# EAGLE design Auto2018 (EAGLE 8.7.1)

## Sheet 1 of 3
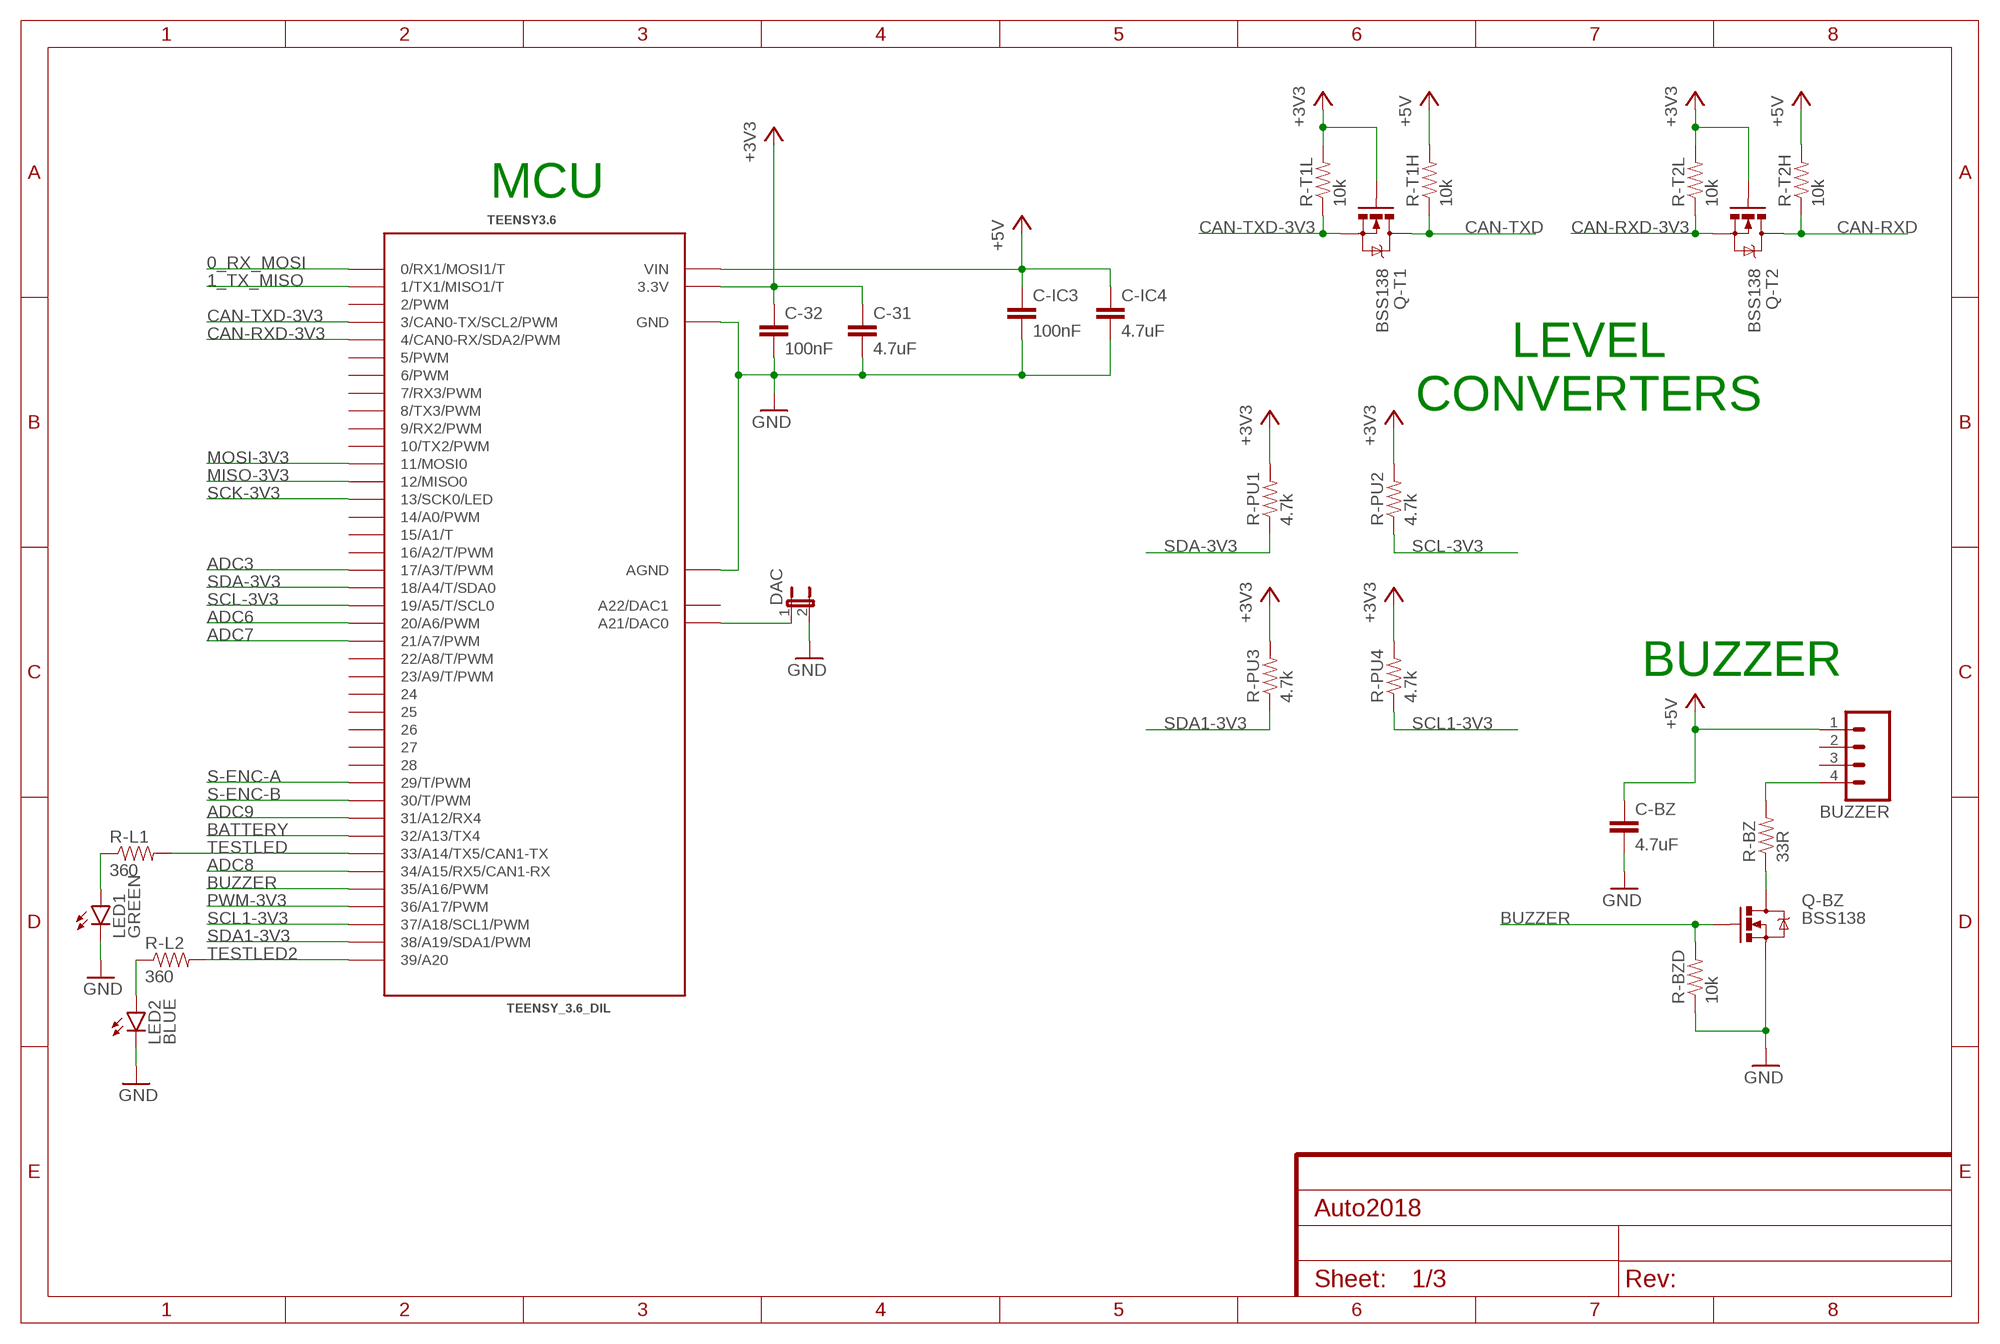
[diagram p0: schematic, sheet 1]
A (FRAME-A4L): CNAME: Auto2018: MCU and Level converters; CREVISION: 2; DESIGNER: Henning

### Parts
BUZZER  M04POLAR  [MOLEX-1X4]
C-31  4.7uF  CAP1210  [1210]
C-32  100nF  CAP0805  [0805]
C-BZ  4.7uF  CAP1210  [1210]
C-IC3  100nF  CAP0805  [0805]
C-IC4  4.7uF  CAP1210  [1210]
DAC  JUMPER-2PTH  [1X02]
LED1  GREEN  LED1206  [LED-1206]
LED2  BLUE  LED1206  [LED-1206]
Q-BZ  BSS138  MOSFET-NCHANNELBSS123LT1G  [SOT23-3]
Q-T1  BSS138  MOSFET-NCHANNELBSS123LT1G  [SOT23-3]
Q-T2  BSS138  MOSFET-NCHANNELBSS123LT1G  [SOT23-3]
R-BZ  33R  RESISTOR0805-RES  [0805]
R-BZD  10k  RESISTOR0805-RES  [0805]
R-L1  360  RESISTOR0805-RES  [0805]
R-L2  360  RESISTOR0805-RES  [0805]
R-PU1  4.7k  RESISTOR0805-RES  [0805]
R-PU2  4.7k  RESISTOR0805-RES  [0805]
R-PU3  4.7k  RESISTOR0805-RES  [0805]
R-PU4  4.7k  RESISTOR0805-RES  [0805]
R-T1H  10k  RESISTOR0805-RES  [0805]
R-T1L  10k  RESISTOR0805-RES  [0805]
R-T2H  10k  RESISTOR0805-RES  [0805]
R-T2L  10k  RESISTOR0805-RES  [0805]
TEENSY3.6  TEENSY_3.6_DIL  [TEENSY_3.6_DIL]

### Nets
0_RX_MOSI: TEENSY3.6.0(0/RX1/MOSI1/T) ; also sheet 3
1_TX_MISO: TEENSY3.6.1(1/TX1/MISO1/T) ; also sheet 3
+3V3: C-31.1 C-32.1 Q-T1.1(G) Q-T2.1(G) R-PU1.2 R-PU2.2 R-PU3.2 R-PU4.2 R-T1L.2 R-T2L.2 TEENSY3.6.3.3V TEENSY3.6.3.3V3(3.3V) ; also sheet 3
+5V: BUZZER.1 C-BZ.1 C-IC3.1 C-IC4.1 R-T1H.2 R-T2H.2 TEENSY3.6.VIN ; also sheet 2,3
ADC3: TEENSY3.6.17/A3(17/A3/T/PWM) ; also sheet 3
ADC6: TEENSY3.6.20/A6(20/A6/PWM) ; also sheet 3
ADC7: TEENSY3.6.21/A7(21/A7/PWM) ; also sheet 3
ADC8: TEENSY3.6.34/A15(34/A15/RX5/CAN1-RX) ; also sheet 3
ADC9: TEENSY3.6.31/A12(31/A12/RX4) ; also sheet 3
BATTERY: TEENSY3.6.32/A13(32/A13/TX4) ; also sheet 3
BUZZER: Q-BZ.1(G) R-BZD.2 TEENSY3.6.35/A16(35/A16/PWM)
CAN-RXD: Q-T2.3(D) R-T2H.1 ; also sheet 2
CAN-RXD-3V3: Q-T2.2(S) R-T2L.1 TEENSY3.6.4(4/CAN0-RX/SDA2/PWM)
CAN-TXD: Q-T1.3(D) R-T1H.1 ; also sheet 2
CAN-TXD-3V3: Q-T1.2(S) R-T1L.1 TEENSY3.6.3(3/CAN0-TX/SCL2/PWM)
GND: C-31.2 C-32.2 C-BZ.2 C-IC3.2 C-IC4.2 DAC.2 LED1.C LED2.C Q-BZ.2(S) R-BZD.1 TEENSY3.6.AGND TEENSY3.6.GND TEENSY3.6.GND1(GND) ; also sheet 2,3
MISO-3V3: TEENSY3.6.12(12/MISO0) ; also sheet 3
MOSI-3V3: TEENSY3.6.11(11/MOSI0) ; also sheet 3
N$1: LED1.A R-L1.1
N$2: LED2.A R-L2.1
N$5: DAC.1 TEENSY3.6.A21(A21/DAC0)
N$14: BUZZER.4 R-BZ.2
N$15: Q-BZ.3(D) R-BZ.1
PWM-3V3: TEENSY3.6.36/A17(36/A17/PWM) ; also sheet 3
S-ENC-A: TEENSY3.6.29(29/T/PWM) ; also sheet 3
S-ENC-B: TEENSY3.6.30(30/T/PWM) ; also sheet 3
SCK-3V3: TEENSY3.6.13(13/SCK0/LED) ; also sheet 3
SCL1-3V3: R-PU4.1 TEENSY3.6.37/A18(37/A18/SCL1/PWM) ; also sheet 3
SCL-3V3: R-PU2.1 TEENSY3.6.19/A5(19/A5/T/SCL0) ; also sheet 2,3
SDA1-3V3: R-PU3.1 TEENSY3.6.38/A19(38/A19/SDA1/PWM) ; also sheet 3
SDA-3V3: R-PU1.1 TEENSY3.6.18/A4(18/A4/T/SDA0) ; also sheet 2,3
TESTLED: R-L1.2 TEENSY3.6.33/A14(33/A14/TX5/CAN1-TX)
TESTLED2: R-L2.2 TEENSY3.6.39/A20
Unconnected: BUZZER.2 BUZZER.3 TEENSY3.6.2(2/PWM) TEENSY3.6.5(5/PWM) TEENSY3.6.6(6/PWM) TEENSY3.6.7(7/RX3/PWM) TEENSY3.6.8(8/TX3/PWM) TEENSY3.6.9(9/RX2/PWM) TEENSY3.6.10(10/TX2/PWM) TEENSY3.6.14/A0(14/A0/PWM) TEENSY3.6.15/A1(15/A1/T) TEENSY3.6.16/A2(16/A2/T/PWM) TEENSY3.6.22/A8(22/A8/T/PWM) TEENSY3.6.23/A9(23/A9/T/PWM) TEENSY3.6.24 TEENSY3.6.25 TEENSY3.6.26 TEENSY3.6.27 TEENSY3.6.28 TEENSY3.6.A22(A22/DAC1)

### Notes on the sheet
- MCU
- LEVEL
  CONVERTERS
- BUZZER

## Sheet 2 of 3
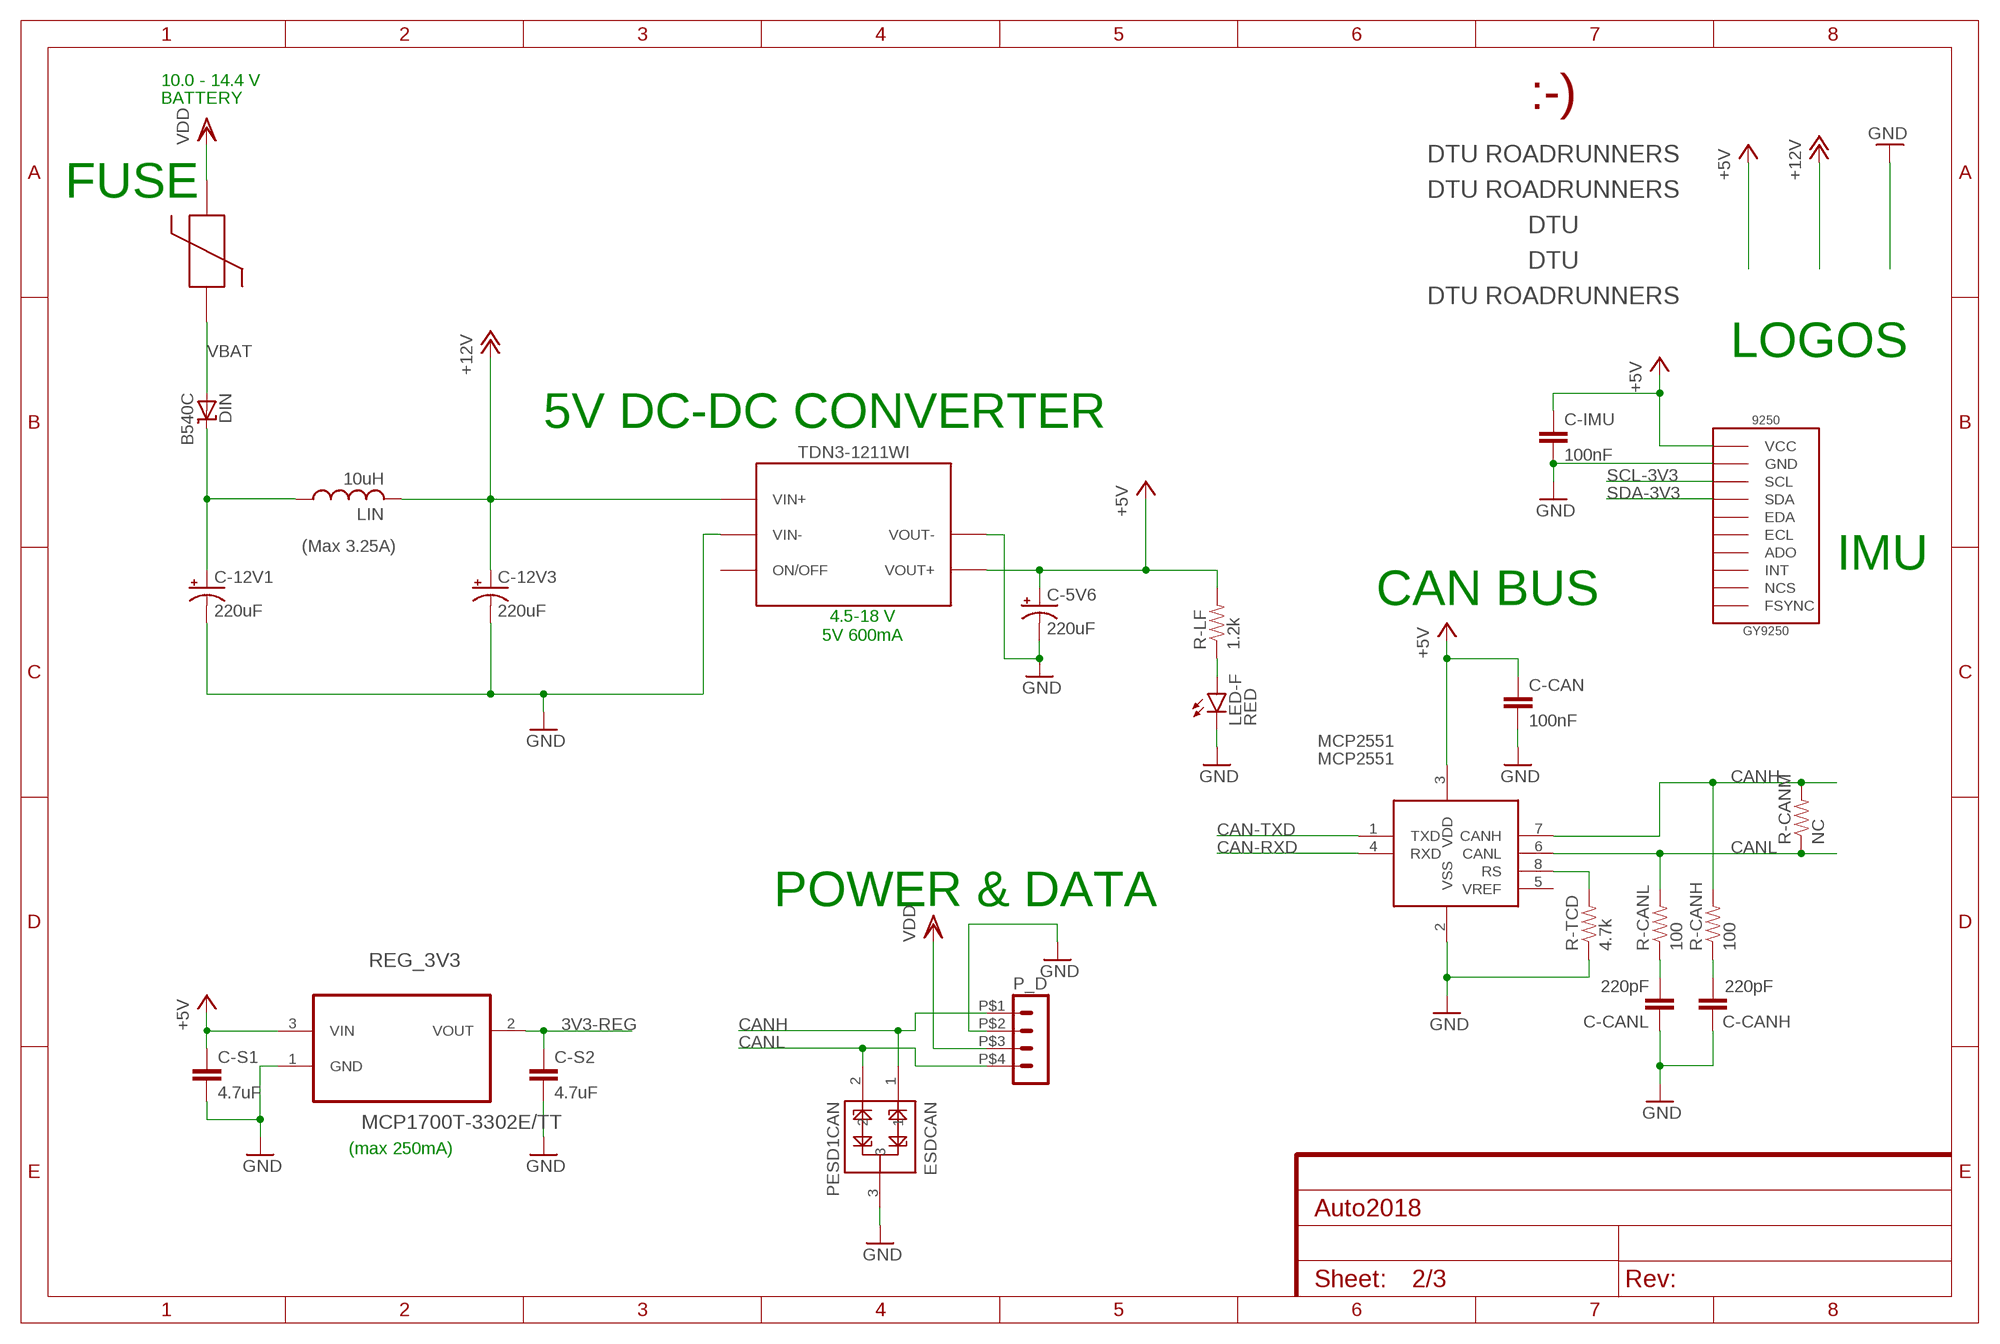
[diagram p1: schematic, sheet 2]
FRAME2 (FRAME-A4L): CNAME: Auto2018: Active components; CREVISION: 2; DESIGNER: Henning

### Parts
9250  GY9250  [GY9250]
C-5V6  220uF  CPOL-USD  [PANASONIC_D]
C-12V1  220uF  CPOL-USD  [PANASONIC_D]
C-12V3  220uF  CPOL-USD  [PANASONIC_D]
C-CAN  100nF  CAP0805  [0805]
C-CANH  220pF  CAP0805  [0805]
C-CANL  220pF  CAP0805  [0805]
C-IMU  100nF  CAP0805  [0805]
C-S1  4.7uF  CAP1210  [1210]
C-S2  4.7uF  CAP1210  [1210]
DIN  B540C  SD-SMC  [SMC]
ESDCAN  PESD1CAN  [SOT23-3]
LED-F  RED  LED1206  [LED-1206]
LIN  10uH  WE-LHMI_SMD_POWER_INDUCTOR  [WE-LHMI_SMD_POWER_INDUCTOR]
MAIN_FUSE  SMF_OMNI-BLOK_FUSE_BLOCK  [SMF_OMNI-BLOK_FUSE_BLOCK]
MCP2551  MCP2551  [SO-08M]
P_D  HEADER_POS4_43045-0401  [43045-0400]
R-CANH  100  RESISTOR0805-RES  [0805]
R-CANL  100  RESISTOR0805-RES  [0805]
R-CANM  NC  RESISTOR0805-RES  [0805]
R-LF  1.2k  RESISTOR0805-RES  [0805]
R-TCD  4.7k  RESISTOR0805-RES  [0805]
REG_3V3  MCP1700T-3302E/TT  [SOT95P237X112-3N]
TDN3-1211WI  TDN3WI  [TDC3WI]
U$3  DTUMEDIUM-9MM  [DTU-MEDIUM-9MM]
U$4  ROADRUNNERSFULL  [ROADRUNNERS-FULL]
U$5  ROADRUNNERSSMALL  [ROADRUNNERS-SMALL]
U$6  SMILEY  [SMILEY]
U$8  DTUSMALL  [DTU-SMALL-5MM]
U$9  ROADRUNNERSFULL  [ROADRUNNERS-FULL]

### Nets
3V3-REG: C-S2.1 REG_3V3.2(VOUT) ; also sheet 3
+5V: 9250.P$VCC(VCC) C-5V6.+ C-CAN.1 C-IMU.1 C-S1.1 MCP2551.3(VDD) R-LF.2 REG_3V3.3(VIN) TDN3-1211WI.VOUT+ ; also sheet 1,3
+12V: C-12V3.+ LIN.P$2 TDN3-1211WI.VIN+
CAN-RXD: MCP2551.4(RXD) ; also sheet 1
CAN-TXD: MCP2551.1(TXD) ; also sheet 1
CANH: ESDCAN.1 MCP2551.7(CANH) P_D.P$1 R-CANH.2 R-CANM.2
CANL: ESDCAN.2 MCP2551.6(CANL) P_D.P$4 R-CANL.2 R-CANM.1
GND: 9250.P$GND(GND) C-5V6.- C-12V1.- C-12V3.- C-CAN.2 C-CANH.1 C-CANL.1 C-IMU.2 C-S1.2 C-S2.2 ESDCAN.3 LED-F.C MCP2551.2(VSS) P_D.P$2 R-TCD.1 REG_3V3.1(GND) TDN3-1211WI.VIN- TDN3-1211WI.VOUT- ; also sheet 1,3
N$9: C-12V1.+ DIN.C LIN.P$1
N$12: LED-F.A R-LF.1
N$25: C-CANL.2 R-CANL.1
N$26: C-CANH.2 R-CANH.1
RS: MCP2551.8(RS) R-TCD.2
SCL-3V3: 9250.P$SCL(SCL) ; also sheet 1,3
SDA-3V3: 9250.P$SDA(SDA) ; also sheet 1,3
VBAT: DIN.A MAIN_FUSE.PIN1 ; also sheet 3
VDD: MAIN_FUSE.PIN2 P_D.P$3
Unconnected: 9250.P$ADO(ADO) 9250.P$ECL(ECL) 9250.P$EDA(EDA) 9250.P$FSYNC(FSYNC) 9250.P$INT(INT) 9250.P$NCS(NCS) MCP2551.5(VREF) TDN3-1211WI.ONOFF(ON/OFF)

### Notes on the sheet
- 10.0 - 14.4 V
- BATTERY
- FUSE
- LOGOS
- 5V DC-DC CONVERTER
- (Max 3.25A)
- IMU
- CAN BUS
- 4.5-18 V
  5V 600mA
- POWER & DATA
- (max 250mA)

## Sheet 3 of 3
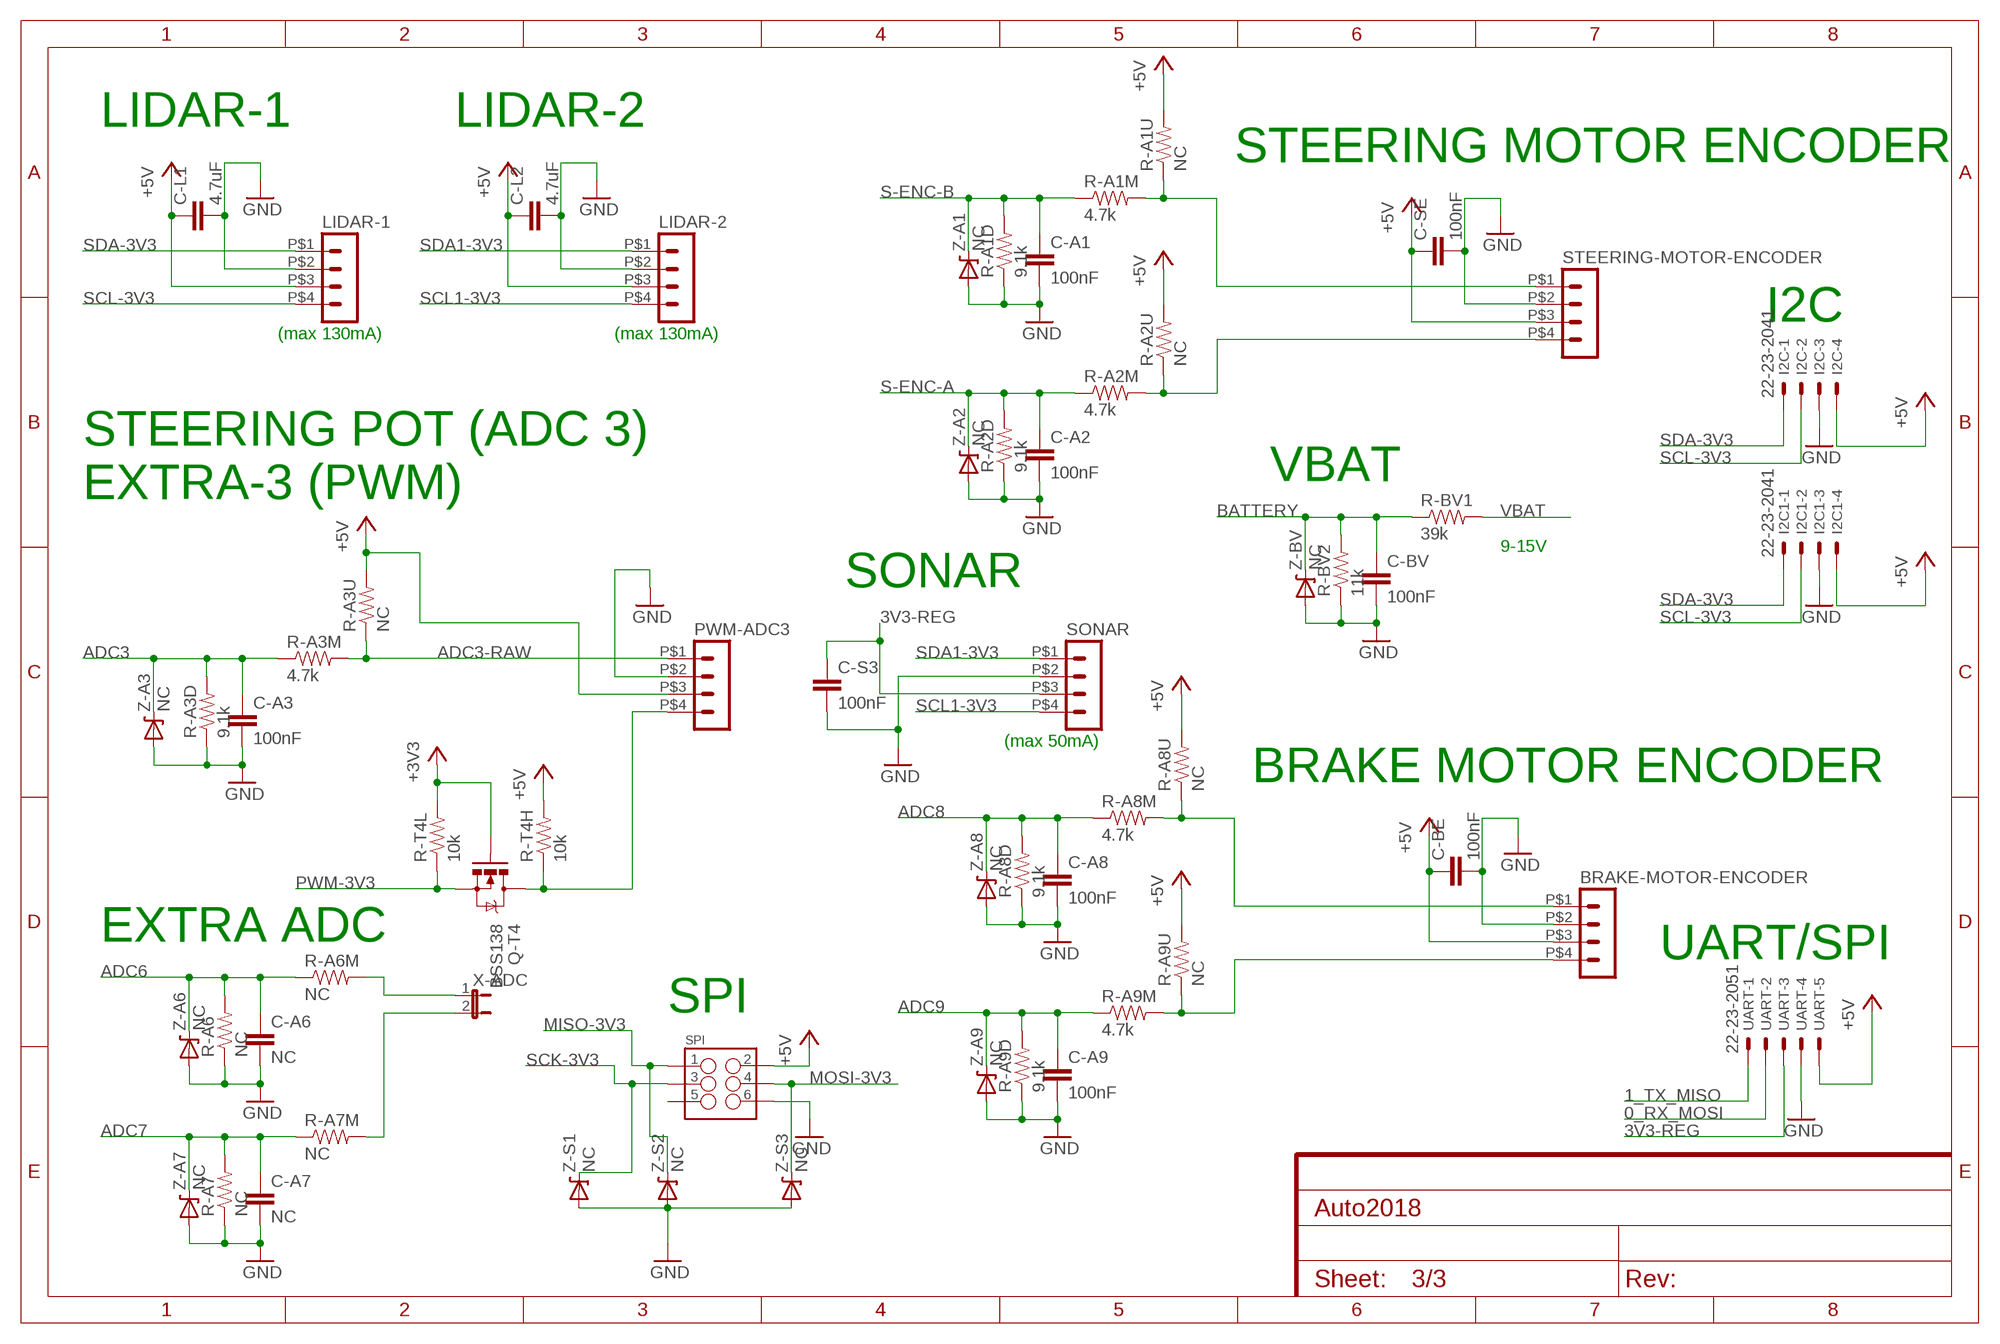
[diagram p2: schematic, sheet 3]
FRAME1 (FRAME-A4L): CNAME: Auto2018: External connections; CREVISION: 2; DESIGNER: Henning

### Parts
BRAKE-MOTOR-ENCODER  HEADER_POS4_43045-0401  [43045-0400]
C-A1  100nF  CAP0805  [0805]
C-A2  100nF  CAP0805  [0805]
C-A3  100nF  CAP0805  [0805]
C-A6  NC  CAP0805  [0805]
C-A7  NC  CAP0805  [0805]
C-A8  100nF  CAP0805  [0805]
C-A9  100nF  CAP0805  [0805]
C-BE  100nF  CAP0805  [0805]
C-BV  100nF  CAP0805  [0805]
C-L1  4.7uF  CAP1210  [1210]
C-L2  4.7uF  CAP1210  [1210]
C-S3  100nF  CAP0805  [0805]
C-SE  100nF  CAP0805  [0805]
I2C  22-23-2041  [22-23-2041]
I2C1  22-23-2041  [22-23-2041]
LIDAR-1  HEADER_POS4_43045-0401  [43045-0400]
LIDAR-2  HEADER_POS4_43045-0401  [43045-0400]
PWM-ADC3  HEADER_POS4_43045-0401  [43045-0400]
Q-T4  BSS138  MOSFET-NCHANNELBSS123LT1G  [SOT23-3]
R-A1D  9.1k  RESISTOR0805-RES  [0805]
R-A1M  4.7k  RESISTOR0805-RES  [0805]
R-A1U  NC  RESISTOR0805-RES  [0805]
R-A2D  9.1k  RESISTOR0805-RES  [0805]
R-A2M  4.7k  RESISTOR0805-RES  [0805]
R-A2U  NC  RESISTOR0805-RES  [0805]
R-A3D  9.1k  RESISTOR0805-RES  [0805]
R-A3M  4.7k  RESISTOR0805-RES  [0805]
R-A3U  NC  RESISTOR0805-RES  [0805]
R-A6  NC  RESISTOR0805-RES  [0805]
R-A6M  NC  RESISTOR0805-RES  [0805]
R-A7  NC  RESISTOR0805-RES  [0805]
R-A7M  NC  RESISTOR0805-RES  [0805]
R-A8D  9.1k  RESISTOR0805-RES  [0805]
R-A8M  4.7k  RESISTOR0805-RES  [0805]
R-A8U  NC  RESISTOR0805-RES  [0805]
R-A9D  9.1k  RESISTOR0805-RES  [0805]
R-A9M  4.7k  RESISTOR0805-RES  [0805]
R-A9U  NC  RESISTOR0805-RES  [0805]
R-BV1  39k  RESISTOR0805-RES  [0805]
R-BV2  11k  RESISTOR0805-RES  [0805]
R-T4H  10k  RESISTOR0805-RES  [0805]
R-T4L  10k  RESISTOR0805-RES  [0805]
SONAR  HEADER_POS4_43045-0401  [43045-0400]
SPI  M03X2POGO_PINS  [2X3_POGO]
STEERING-MOTOR-ENCODER  HEADER_POS4_43045-0401  [43045-0400]
UART  22-23-2051  [22-23-2051]
X-ADC  JUMPER-2PTH  [1X02]
Z-A1  NC  ZENER  [SOD123@1]
Z-A2  NC  ZENER  [SOD123@1]
Z-A3  NC  ZENER  [SOD123@1]
Z-A6  NC  ZENER  [SOD123@1]
Z-A7  NC  ZENER  [SOD123@1]
Z-A8  NC  ZENER  [SOD123@1]
Z-A9  NC  ZENER  [SOD123@1]
Z-BV  NC  ZENER  [SOD123@1]
Z-S1  NC  ZENER  [SOD123@1]
Z-S2  NC  ZENER  [SOD123@1]
Z-S3  NC  ZENER  [SOD123@1]

### Nets
0_RX_MOSI: UART.2 ; also sheet 1
1_TX_MISO: UART.1 ; also sheet 1
3V3-REG: C-S3.1 SONAR.P$3 UART.3 ; also sheet 2
+3V3: Q-T4.1(G) R-T4L.2 ; also sheet 1
+5V: BRAKE-MOTOR-ENCODER.P$3 C-BE.1 C-L1.1 C-L2.1 C-SE.1 I2C1.4 I2C.4 LIDAR-1.P$3 LIDAR-2.P$3 PWM-ADC3.P$3 R-A1U.2 R-A2U.2 R-A3U.2 R-A8U.2 R-A9U.2 R-T4H.2 SPI.P$2 STEERING-MOTOR-ENCODER.P$3 UART.5 ; also sheet 1,2
ADC3: C-A3.1 R-A3D.2 R-A3M.1 Z-A3.C ; also sheet 1
ADC3-RAW: PWM-ADC3.P$1 R-A3M.2 R-A3U.1
ADC6: C-A6.1 R-A6.2 R-A6M.1 Z-A6.C ; also sheet 1
ADC6-RAW: R-A6M.2 X-ADC.1
ADC7: C-A7.1 R-A7.2 R-A7M.1 Z-A7.C ; also sheet 1
ADC7-RAW: R-A7M.2 X-ADC.2
ADC8: C-A8.1 R-A8D.2 R-A8M.1 Z-A8.C ; also sheet 1
ADC8-RAW: BRAKE-MOTOR-ENCODER.P$1 R-A8M.2 R-A8U.1
ADC9: C-A9.1 R-A9D.2 R-A9M.1 Z-A9.C ; also sheet 1
ADC9-RAW: BRAKE-MOTOR-ENCODER.P$4 R-A9M.2 R-A9U.1
BATTERY: C-BV.1 R-BV1.1 R-BV2.2 Z-BV.C ; also sheet 1
GND: BRAKE-MOTOR-ENCODER.P$2 C-A1.2 C-A2.2 C-A3.2 C-A6.2 C-A7.2 C-A8.2 C-A9.2 C-BE.2 C-BV.2 C-L1.2 C-L2.2 C-S3.2 C-SE.2 I2C1.3 I2C.3 LIDAR-1.P$2 LIDAR-2.P$2 PWM-ADC3.P$2 R-A1D.1 R-A2D.1 R-A3D.1 R-A6.1 R-A7.1 R-A8D.1 R-A9D.1 R-BV2.1 SONAR.P$2 SPI.P$6 STEERING-MOTOR-ENCODER.P$2 UART.4 Z-A1.A Z-A2.A Z-A3.A Z-A6.A Z-A7.A Z-A8.A Z-A9.A Z-BV.A Z-S1.A Z-S2.A Z-S3.A ; also sheet 1,2
MISO-3V3: SPI.P$1 Z-S2.C ; also sheet 1
MOSI-3V3: SPI.P$4 Z-S3.C ; also sheet 1
PWM-3V3: Q-T4.2(S) R-T4L.1 ; also sheet 1
PWM-5V: PWM-ADC3.P$4 Q-T4.3(D) R-T4H.1
S-ENC-A: C-A2.1 R-A2D.2 R-A2M.1 Z-A2.C ; also sheet 1
S-ENC-A-RAW: R-A2M.2 R-A2U.1 STEERING-MOTOR-ENCODER.P$4
S-ENC-B: C-A1.1 R-A1D.2 R-A1M.1 Z-A1.C ; also sheet 1
S-ENC-B-RAW: R-A1M.2 R-A1U.1 STEERING-MOTOR-ENCODER.P$1
SCK-3V3: SPI.P$3 Z-S1.C ; also sheet 1
SCL1-3V3: LIDAR-2.P$4 SONAR.P$4 ; also sheet 1
SCL-3V3: I2C1.2 I2C.2 LIDAR-1.P$4 ; also sheet 1,2
SDA1-3V3: LIDAR-2.P$1 SONAR.P$1 ; also sheet 1
SDA-3V3: I2C1.1 I2C.1 LIDAR-1.P$1 ; also sheet 1,2
VBAT: R-BV1.2 ; also sheet 2
Unconnected: SPI.P$5

### Notes on the sheet
- LIDAR-1 | LIDAR-2
- STEERING MOTOR ENCODER
- I2C
- (max 130mA) | (max 130mA)
- VBAT
- STEERING POT (ADC 3)
  EXTRA-3 (PWM)
- 9-15V
- SONAR
- (max 50mA)
- BRAKE MOTOR ENCODER
- EXTRA ADC
- UART/SPI
- SPI

## Library data of the parts
9250 = GY9250:GY9250: GY9250/6500 MPU-9250 module (3 axis accelerator, 3 axis gyro and 3 axis magnetometer) Chip: MPU9250; Power voltage: 3~5V Communication mode: I2C / SPI; Gyro range: +/-250, +/-500, +/-1000, +/-2000dps Accelerator range: +/-2G, +/-4G, +/-8G, +/-16G Magnetometer range: +/-4800uF Pin spacing: 2.54mm Bought from AliExpress <https://www.aliexpress.com/item/SPI-IIC-MPU-9250-9-Axis-Attitude-Gyro-Accelerator-Magnetometer-Sensor-Module/1893522629.html>
BRAKE-MOTOR-ENCODER LIDAR-1 LIDAR-2 P_D PWM-ADC3 SONAR STEERING-MOTOR-ENCODER = con-molex-micro-fit-3_0:HEADER_POS4_?: Molex - Micro-Fit 3.0 Series connector, 3.00mm (0.118") pitch header, 4 positions.
BUZZER = SparkFun-Connectors:M04: Header 4 Standard 4-pin 0.1" header. Use with straight break away headers (SKU : PRT-00116), right angle break away headers (PRT-00553), swiss pins (PRT-00743), machine pins (PRT-00117), and female headers (PRT-00115). Molex polarized connector foot print use with SKU : PRT-08231 with associated crimp pins and housings. 1MM SMD Version SKU: PRT-10208
C-5V6 C-12V1 C-12V3 = rcl:CPOL-US: POLARIZED CAPACITOR, American symbol; RS: 729-6258
C-31 C-32 C-A1-C-A3 C-A6-C-A9 C-BE C-BV C-BZ C-CAN C-CANH C-CANL C-IC3 C-IC4 C-IMU C-L1 C-L2 C-S1-C-S3 C-SE = SparkFun-Passives:CAP: Capacitor Standard 0603 ceramic capacitor, and 0.1" leaded capacitor.
DAC X-ADC = SparkFun-Retired:JUMPER-2: Jumper Basic 0.1" spaced jumper. Use with breakaway headers.
DIN = diodes:SD-: Schottky diode
ESDCAN = SparkFun-DiscreteSemi:PESD1CAN: PESD1CAN is used to protect two automotive CAN bus lines from ESD.; PROD_ID: DIO-12501
I2C I2C1 = con-molex:22-23-2041: .100" (2.54mm) Center Header - 4 Pin; MF: MOLEX; MPN: 22-23-2041; OC_FARNELL: 1462920; OC_NEWARK: 38C0355
LED1 LED2 LED-F = SparkFun-LED:LED: LEDs Standard schematic elements and footprints for 5mm, 3mm, 1206, and 0603 sized LEDs. 5mm - Spark Fun Electronics SKU : COM-00529 (and others)
LIN = WE-LHMI_SMD_POWER_INDUCTOR2:WE-LHMI_SMD_POWER_INDUCTOR; RS: 756-8590
MAIN_FUSE = SMF_OMNI-BLOK_FUSE_BLOCK:SMF_OMNI-BLOK_FUSE_BLOCK
MCP2551 = skpang_lib:MCP2551
Q-BZ Q-T1 Q-T2 Q-T4 = SparkFun-DiscreteSemi:MOSFET-NCHANNEL: Common NMOSFET Parts MFG P/N Store ID Prod ID FDD8780 TRANS-09984 SI7820DN TRANS-11055 FDS6630A IC-08089 2N7002PW TRANS-11151 FQP30N06L COM-10213 TRANS-10060 BSS123LT1G TRANS-08345 BSS138 TRANS-00830 BS170 2N7000; PROD_ID: TRANS-08345
R-A1D R-A1M R-A1U R-A2D R-A2M R-A2U R-A3D R-A3M R-A3U R-A6 R-A6M R-A7 R-A7M R-A8D R-A8M R-A8U R-A9D R-A9M R-A9U R-BV1 R-BV2 R-BZ R-BZD R-CANH R-CANL R-CANM R-L1 R-L2 R-LF R-PU1-R-PU4 R-T1H R-T1L R-T2H R-T2L R-T4H R-T4L R-TCD = SparkFun-Resistors:RESISTOR: Resistor Basic schematic elements and footprints for 0603, 1206, and PTH resistors.
REG_3V3 = Microchip_By_element14_Batch_1:MCP1700T-3302E/TT: Low Quiescent Current LDO; MPN: MCP1700T-3302E/TT; OC_FARNELL: 1296592; OC_NEWARK: 88H9817; PACKAGE: SOT23-3; SUPPLIER: Microchip
SPI = SparkFun-Connectors:M03X2: 2x3 .1" header. Shrouded, with keying- CONN-10681 SMT- CONN-11415 Pogo pins- HW-11044; PROD_ID: HW-11044
TDN3-1211WI = TracoTDN3WI:TDN3WI; RS: 899-8223
TEENSY3.6 = Teensy_3_and_LC_Series_Boards_v1.4:TEENSY_3.6_DIL: Teensy 3.6 DIL Package
U$3 U$8 = Logos:DTU
U$4 U$5 U$9 = Logos:ROADRUNNERS
U$6 = Logos:SMILEY
UART = con-molex:22-23-2051: .100" (2.54mm) Center Header - 5 Pin; MF: MOLEX; MPN: 22-23-2051; OC_FARNELL: 1462952; OC_NEWARK: 38C9178
Z-A1-Z-A3 Z-A6-Z-A9 Z-BV Z-S1-Z-S3 = diodes:ZENER

## Board
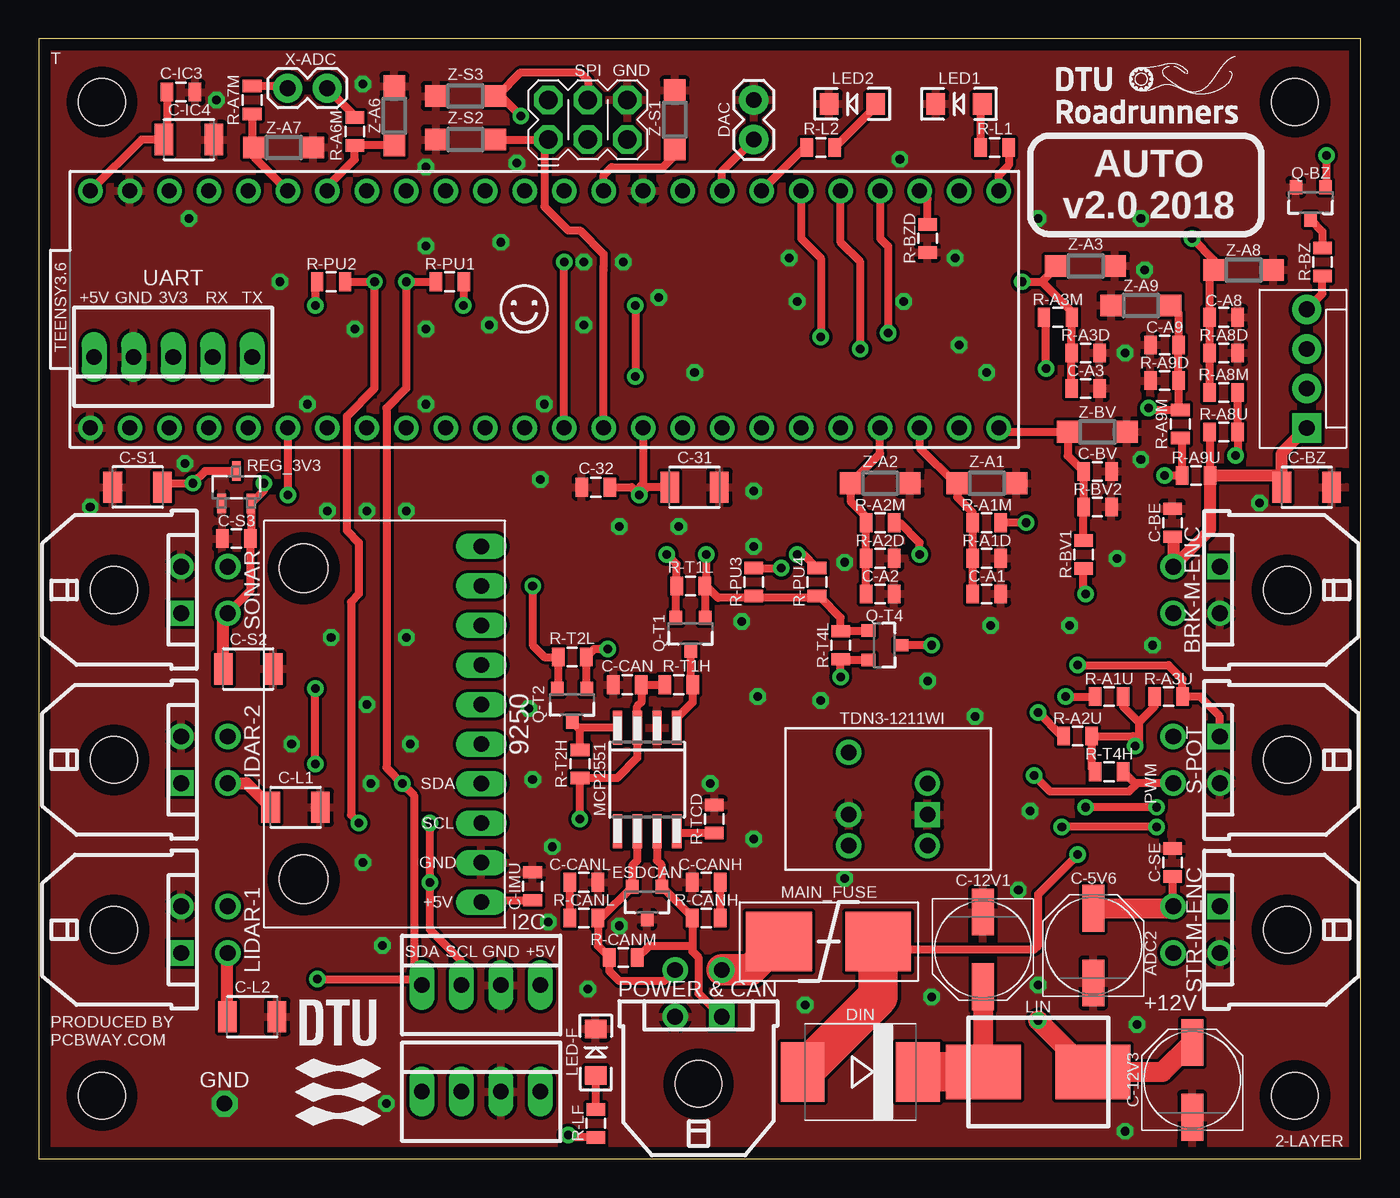
[diagram p3: board, top side]
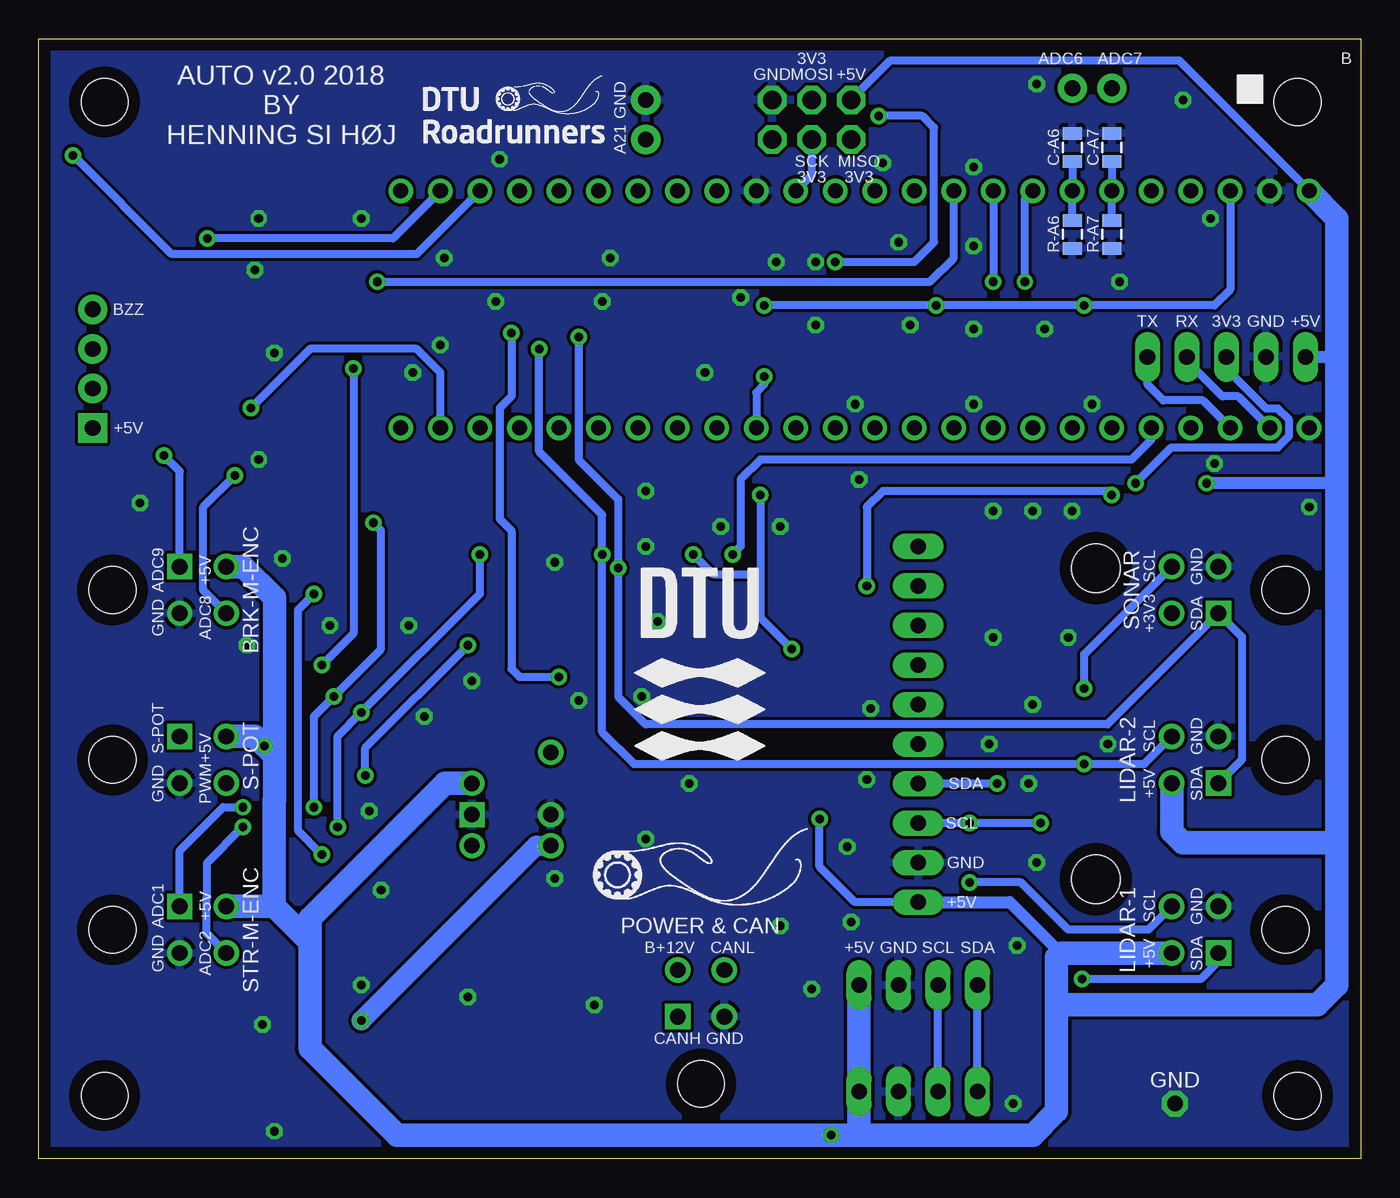
[diagram p4: board, bottom side, seen from below]

Size 85 x 72 mm. Coordinates in mm from the lower left corner, seen from the top.
Outline: 0,0 85,0 85,72 0,72 0,0
Copper layers (1*16): Top 0.035mm / dielectric 1.5mm / Bottom 0.035mm
Design rules "CustomSparkFun2Layer": minimum track width 16mil, minimum drill 20mil, track to track 8mil, track to pad 8mil, pad to pad 8mil, via to via 8mil, smd to smd 8mil, copper to edge 30mil, drill to drill 8mil, minimum pad ring 12mil, minimum via ring 10mil, stop-mask expansion 4mil, vias tented up to drill 25mil, thermal gap 10mil
Holes 3 mm at 4.06,67.94 80.77,67.94 80.77,4.06 4.06,4.06
tKeepout: area 78.1,1.4 to 83.5,6.8; area 1.4,1.4 to 6.8,6.8; area 1.4,65.2 to 6.8,70.6; area 78.1,65.2 to 83.5,70.6; area 14.3,35.3 to 19.7,40.7; area 14.3,15.2 to 19.7,20.6

### Footprints (pad centres in the part's own frame; a part is rotated, then mirrored left to right if it is on the bottom)
GY9250 = drill 1.016 long: P$ADO 3.81,-6.35; P$ECL -1.27,-6.35; P$EDA 1.27,-6.35; P$FSYNC 11.43,-6.35; P$GND -8.89,-6.35; P$INT 6.35,-6.35; P$NCS 8.89,-6.35; P$SCL -6.35,-6.35; P$SDA -3.81,-6.35; P$VCC -11.43,-6.35 | hole 3.1: -9.97,5.08; 10.03,5.08
43045-0400 = drill 1.02 square: P$1 1.5,4.32 | drill 1.02: P$2 -1.5,4.32; P$3 1.5,7.32; P$4 -1.5,7.32 | hole 3: 0,0
MOLEX-1X4 = drill 1.016 pad 1.88 square: 1 0,0 | drill 1.016 pad 1.88: 2 2.54,0; 3 5.08,0; 4 7.62,0
PANASONIC_D = smd 3 x 1.4: + 2.4,0; - -2.4,0
1210 = smd 1.2 x 2: 1 -1.6,0; 2 1.6,0
0805 = smd 0.8 x 1.2: 1 -0.9,0; 2 0.9,0
1X02 = drill 1.016 pad 1.88: 1 0,0; 2 2.54,0
SMC = smd 2.8 x 3.8: A 3.7,0; C -3.7,0
SOT23-3 = smd 0.8 x 0.9: 1 -0.95,-1; 2 0.95,-1; 3 0,1.1
22-23-2041 = drill 1 long: 1 -3.81,0; 2 -1.27,0; 3 1.27,0; 4 3.81,0
LED-1206 = smd 1.2 x 1.4: A -1.5,0; C 1.5,0
WE-LHMI_SMD_POWER_INDUCTOR = smd 4.829 x 3.5: P$1 -3.512,0; P$2 3.512,0
SMF_OMNI-BLOK_FUSE_BLOCK = smd 4.242 x 3.81: PIN1 -3.175,0; PIN2 3.2,0
SO-08M = smd 0.6 x 2.2: 1 -1.905,-3.33; 2 -0.635,-3.33; 3 0.635,-3.33; 4 1.905,-3.33; 5 1.905,3.33; 6 0.635,3.33; 7 -0.635,3.33; 8 -1.905,3.33
SOT95P237X112-3N = smd 0.559 x 1.27: 1 -0.94,-1.041; 2 0.94,-1.041; 3 0,1.041
2X3_POGO = drill 1.2 pad 1.829 octagon: P$1 0,0; P$2 0,2.54; P$3 2.54,0; P$4 2.54,2.54; P$5 5.08,0; P$6 5.08,2.54
TDC3WI = drill 1 pad 1.6: NC 4.065,7.55; ONOFF 9.135,1.55; VIN+ 9.135,7.55; VIN- 9.135,5.55; VOUT+ 4.065,3.55 | drill 1 pad 1.6 square: VOUT- 4.065,5.55
TEENSY_3.6_DIL = drill 0.965: 0 -7.62,25.4; 1 -7.62,22.86; 2 -7.62,20.32; 3 -7.62,17.78; 3.3V 7.62,22.86; 3.3V3 -7.62,-7.62; 4 -7.62,15.24; 5 -7.62,12.7; 6 -7.62,10.16; 7 -7.62,7.62; 8 -7.62,5.08; 9 -7.62,2.54; 10 -7.62,0; 11 -7.62,-2.54; 12 -7.62,-5.08; 13 7.62,-5.08; 14/A0 7.62,-2.54; 15/A1 7.62,0; 16/A2 7.62,2.54; 17/A3 7.62,5.08; 18/A4 7.62,7.62; 19/A5 7.62,10.16; 20/A6 7.62,12.7; 21/A7 7.62,15.24; 22/A8 7.62,17.78; 23/A9 7.62,20.32; 24 -7.62,-10.16; 25 -7.62,-12.7; 26 -7.62,-15.24; 27 -7.62,-17.78; 28 -7.62,-20.32; 29 -7.62,-22.86; 30 -7.62,-25.4; 31/A12 -7.62,-27.94; 32/A13 -7.62,-30.48; 33/A14 7.62,-30.48; 34/A15 7.62,-27.94; 35/A16 7.62,-25.4; 36/A17 7.62,-22.86; 37/A18 7.62,-20.32; 38/A19 7.62,-17.78; 39/A20 7.62,-15.24; A21 7.62,-12.7; A22 7.62,-10.16; AGND 7.62,25.4; GND -7.62,27.94; GND1 7.62,-7.62; VIN 7.62,27.94
22-23-2051 = drill 1 long: 1 -5.08,0; 2 -2.54,0; 3 0,0; 4 2.54,0; 5 5.08,0
SOD123@1 = smd 1.4 x 1.4: A 1.9,0; C -1.9,0

### Placement (x,y rotation side)
9250  22.1,27.94 90 top
BRAKE-MOTOR-ENCODER  80.26,36.58 90 top
BUZZER  81.53,46.99 90 top
C-5V6  67.82,13.72 90 top
C-12V1  60.71,13.46 270 top
C-12V3  74.17,5.08 90 top
C-31  42.16,43.18 0 top
C-32  35.81,43.18 180 top
C-A1  60.96,36.32 0 top
C-A2  54.1,36.32 0 top
C-A3  67.31,49.53 0 top
C-A6  18.54,65.02 90 bottom
C-A7  16,65.02 90 bottom
C-A8  76.2,54.1 0 top
C-A9  72.39,52.32 180 top
C-BE  72.9,40.89 90 top
C-BV  68.07,44.2 0 top
C-BZ  81.53,43.18 0 top
C-CAN  37.85,30.48 180 top
C-CANH  42.93,17.78 0 top
C-CANL  35.05,17.78 180 top
C-IC3  9.14,68.58 0 top
C-IC4  9.65,65.53 0 top
C-IMU  31.75,17.53 90 top
C-L1  16.51,22.61 0 top
C-L2  13.72,9.14 0 top
C-S1  6.35,43.18 180 top
C-S2  13.46,31.5 0 top
C-S3  12.7,39.88 180 top
C-SE  72.9,19.05 90 top
DAC  45.97,65.53 90 top
DIN  52.83,5.59 180 top
ESDCAN  39.12,16.51 180 top
I2C  28.45,11.18 0 top
I2C1  28.45,4.32 0 top
LED1  59.18,67.82 180 top
LED2  52.32,67.82 180 top
LED-F  35.81,6.86 90 top
LIDAR-1  4.83,14.73 270 top
LIDAR-2  4.83,25.65 270 top
LIN  64.26,5.59 0 top
MAIN_FUSE  50.8,13.97 180 top
MCP2551  39.12,24.38 180 top
P_D  42.42,4.83 0 top
PWM-ADC3  80.26,25.65 90 top
Q-BZ  81.79,61.47 180 top
Q-T1  41.91,33.78 180 top
Q-T2  34.29,29.21 180 top
Q-T4  54.36,33.02 270 top
R-A1D  60.96,38.61 180 top
R-A1M  60.96,40.89 0 top
R-A1U  68.83,29.72 0 top
R-A2D  54.1,38.61 180 top
R-A2M  54.1,40.89 0 top
R-A2U  66.8,27.18 0 top
R-A3D  67.31,51.82 180 top
R-A3M  65.53,54.1 180 top
R-A3U  72.64,29.72 180 top
R-A6  18.54,59.44 90 bottom
R-A6M  20.32,66.04 90 top
R-A7  16,59.44 90 bottom
R-A7M  13.72,68.07 90 top
R-A8D  76.2,51.82 180 top
R-A8M  76.2,49.28 0 top
R-A8U  76.2,46.74 180 top
R-A9D  72.39,50.04 0 top
R-A9M  73.41,47.24 270 top
R-A9U  74.42,43.94 0 top
R-BV1  67.18,38.86 270 top
R-BV2  68.07,41.91 180 top
R-BZ  82.55,57.66 270 top
R-BZD  57.15,59.18 90 top
R-CANH  42.93,15.49 180 top
R-CANL  35.05,15.49 0 top
R-CANM  37.59,12.95 0 top
R-L1  61.47,65.02 0 top
R-L2  50.29,65.02 180 top
R-LF  35.81,2.29 270 top
R-PU1  26.42,56.39 0 top
R-PU2  18.8,56.39 180 top
R-PU3  45.97,37.08 270 top
R-PU4  50.04,37.08 270 top
R-T1H  41.15,30.48 180 top
R-T1L  41.91,36.83 0 top
R-T2H  34.8,25.4 270 top
R-T2L  34.29,32.26 0 top
R-T4H  68.83,24.89 180 top
R-T4L  51.56,33.02 90 top
R-TCD  43.43,21.84 270 top
REG_3V3  12.7,43.18 0 top
SONAR  4.83,36.58 270 top
SPI  32.77,65.53 0 top
STEERING-MOTOR-ENCODER  80.26,14.73 90 top
TDN3-1211WI  61.21,27.69 180 top
TEENSY3.6  31.24,54.61 90 top
U$3  42.47,32.51 0 bottom
U$4  71.37,68.83 0 top
U$5  42.47,18.8 0 bottom
U$6  31.24,54.61 0 top
U$8  19.3,6.86 0 top
U$9  54.36,67.56 0 bottom
UART  8.64,51.56 180 top
X-ADC  18.54,68.83 180 top
Z-A1  60.96,43.43 0 top
Z-A2  54.1,43.43 0 top
Z-A3  67.31,57.4 0 top
Z-A6  22.86,67.06 90 top
Z-A7  15.75,65.02 0 top
Z-A8  77.47,57.15 0 top
Z-A9  70.87,54.86 180 top
Z-BV  68.07,46.74 0 top
Z-S1  40.89,66.8 90 top
Z-S2  27.43,65.53 180 top
Z-S3  27.43,68.33 180 top

### Tracks (layer width: path | path; a pad name or v marks a point on that pad's centre or on a via)
0_RX_MOSI
  Bottom 0.508: TEENSY3.6.0 7.87,49.02 8.89,49.02 11.18,51.31 UART.2
1_TX_MISO
  Bottom 0.508: TEENSY3.6.1 10.16,48.77 12.7,48.77 13.72,49.78 UART.1
3V3-REG  (via drill 0.55)
  Top 0.508: SONAR.P$3 13.6,36.53 C-S3.1 13.64,39.92 REG_3V3.2 14.48,42.98 v14.48,43.43
  Top 0.762: C-S2.1 11.86,34.79 SONAR.P$3
  Bottom 0.508: v14.48,43.43 12.17,45.74 5.33,45.74 4.6,46.47 4.6,47.51 5.33,48.23 6.08,48.23 8.64,50.79 UART.3
+3V3  (via drill 0.55)
  Top 0.508: Q-T2.1 35.19,30.26 R-T2L.2 35.7,32.77 v36.58,32.77 | Q-T1.1 42.86,36.78 | 42.86,36.78 R-T1L.2 42.93,36.95 | v38.35,54.86 v38.35,50.29 | C-32.1 38.12,43.18 38.12,43.16 38.35,42.93 | 49.92,36.07 50.29,36.07 51.56,34.8 R-T4L.2 53.31,33.92 Q-T4.1 | 49.92,36.07 45.97,36.07 | 45.97,36.07 43.69,36.07 42.98,36.78 | 42.98,36.78 42.93,36.83 v42.93,38.86 | 42.86,36.78 42.98,36.78 | 38.35,42.93 v38.61,42.67 39.12,43.18 C-31.1 | 38.35,42.93 38.86,43.43 TEENSY3.6.3.3V3 | R-PU2.2 17.78,56.27 v17.78,54.86 | R-PU1.2 27.32,54.88 v27.3,54.86 | R-PU3.2 45.97,36.07 | R-PU4.2 49.92,36.07
  Bottom 0.508: TEENSY3.6.3.3V 8.38,55.88 9.4,54.86 v17.78,54.86 v27.3,54.86 v38.35,54.86 | v38.35,50.29 38.35,49.78 38.86,49.28 TEENSY3.6.3.3V3 | v42.93,38.86 41.66,37.59 38.61,37.59 | v36.58,32.77 38.61,34.8 38.61,37.59 | v38.61,42.67 38.61,37.59
+5V  (via drill 0.55)
  Top 0.508: R-T1H.2 C-CAN.1 38.75,29.35 38.48,29.08 MCP2551.3 38.48,25.78 37.2,24.5 R-T2H.2 v34.8,21.84 | v34.04,1.52 34.17,1.39 R-LF.2 | C-IC3.1 8.24,65.72 C-IC4.1 6.6,65.53 TEENSY3.6.VIN | 70.74,28.07 70.74,26.8 v70.48,26.54 70.36,27.18 R-A2U.2 67.7,25.12 R-T4H.2 | R-A3U.2 71.74,29.07 70.74,28.07 | R-A1U.2 69.73,29.07 70.74,28.07 | C-S1.1 8.2,43.43 v9.91,43.43 10.69,44.22 REG_3V3.3 | 9250.P$VCC 28.56,16.63 C-IMU.1 | C-SE.1 72.9,16.28 STEERING-MOTOR-ENCODER.P$3 | R-A9U.2 75.32,46.71 R-A8U.2
  Top 0.762: C-L2.1 12.12,13.2 LIDAR-1.P$3 | LIDAR-2.P$3 13.36,24.15 C-L1.1 | C-BZ.1 79.93,43.94 | 79.93,43.94 79.93,45.39 BUZZER.1 | 79.93,43.94 R-A9U.2 75.32,40.45 BRAKE-MOTOR-ENCODER.P$3 72.94,39.95 C-BE.1
  Top 1.27: C-5V6.+ 72.74,16.12 72.9,16.28
  Bottom 0.508: TEENSY3.6.VIN 11.68,70.61 30.23,70.61 SPI.P$2 | v34.8,21.84 34.8,18.8 32.51,16.51 9250.P$VCC | 69.6,23.37 69.86,23.1
  Bottom 0.762: 1.52,43.43 v9.91,43.43 | 9250.P$VCC 22.56,16.51 19.28,13.23 | UART.5 1.52,51.56
  Bottom 1.524: 69.85,25.91 v70.48,26.54 71.12,27.18 72.92,27.18 PWM-ADC3.P$3 | 19.56,9.4 19.56,12.95 19.28,13.23 LIDAR-1.P$3 | 19.56,9.4 19.56,3.05 21.08,1.52 32.26,1.52 | 32.26,1.52 v34.04,1.52 61.98,1.52 67.56,7.11 67.56,13.93 | LIDAR-2.P$3 12.15,21.04 11.43,20.32 1.52,20.32 | 1.52,20.32 1.52,11.18 2.79,9.91 19.05,9.91 19.56,9.4 | 1.52,20.32 1.52,43.43 1.52,51.56 1.52,60.45 TEENSY3.6.VIN | 69.85,25.91 69.85,23.11 69.86,23.1 69.86,16.23 | 32.26,1.52 I2C1.4 I2C.4 | 67.56,13.93 69.86,16.23 | 69.86,16.23 STEERING-MOTOR-ENCODER.P$3 | TDN3-1211WI.VOUT+ 58.89,24.14 67.56,15.46 67.56,13.93 | BRAKE-MOTOR-ENCODER.P$3 71.91,38.08 71.88,38.1 69.85,36.07 69.85,25.91
+12V  (via drill 0.55)
  Top 1.27: C-12V3.+ 72.28,5.59 LIN.P$2 67.56,5.59 v64.26,8.89
  Bottom 1.27: v64.26,8.89 53.02,20.14 TDN3-1211WI.VIN+
ADC3  (via drill 0.55)
  Top 0.508: C-A3.1 R-A3D.2 R-A3M.1 66.41,54.49 64.52,56.39 | v63.25,56.39 64.52,56.39 | Z-A3.C 65.41,57.28 64.52,56.39
  Bottom 0.508: v63.25,56.39 27.69,56.39 26.16,57.91 TEENSY3.6.17/A3
ADC3-RAW  (via drill 0.55)
  Top 0.508: PWM-ADC3.P$1 75.94,28.45 74.68,29.72 R-A3U.1 73.54,30.85 72.64,31.75 v66.8,31.75 | v64.77,50.8 64.77,53.96 R-A3M.2
  Bottom 0.508: v66.8,31.75 64.77,33.78 v64.77,50.8
ADC6
  Top 0.508: Z-A6.C 20.34,65.16 R-A6M.1 20.32,64.26 18.54,62.48 TEENSY3.6.20/A6
  Bottom 0.508: R-A6.2 TEENSY3.6.20/A6 C-A6.1
ADC6-RAW
  Top 0.508: R-A6M.2 20.32,67.06 X-ADC.1
ADC7
  Top 0.508: TEENSY3.6.21/A7 13.85,64.38 Z-A7.C 13.72,65.16 R-A7M.1
  Bottom 0.508: R-A7.2 TEENSY3.6.21/A7 C-A7.1
ADC7-RAW
  Top 0.508: R-A7M.2 15.86,68.97 X-ADC.2
ADC8  (via drill 0.55)
  Top 0.508: R-A8M.1 R-A8D.2 C-A8.1 75.3,56.88 Z-A8.C 75.57,57.78 v74.17,59.18
  Bottom 0.508: TEENSY3.6.34/A15 62.23,59.18 v74.17,59.18
ADC8-RAW  (via drill 0.55)
  Top 0.508: R-A8M.2 R-A8U.1 77.1,45.35 v76.96,45.21
  Bottom 0.508: BRAKE-MOTOR-ENCODER.P$1 75.94,44.19 v76.96,45.21
ADC9  (via drill 0.55)
  Top 0.508: Z-A9.C 73.29,54.34 C-A9.1 R-A9D.2 73.29,48.26 R-A9M.1 71.49,48.14 v71.37,48.26
  Bottom 0.508: TEENSY3.6.31/A12 59.18,50.55 60.71,52.07 67.56,52.07 v71.37,48.26
ADC9-RAW  (via drill 0.55)
  Top 0.508: v72.39,43.94 R-A9U.1 73.52,46.23 R-A9M.2
  Bottom 0.508: BRAKE-MOTOR-ENCODER.P$4 74.42,36.55 74.42,41.91 v72.39,43.94
BATTERY
  Top 0.508: TEENSY3.6.32/A13 61.98,46.74 Z-BV.C 66.17,45.2 C-BV.1 R-BV2.2 67.17,39.77 R-BV1.1
BUZZER  (via drill 0.55)
  Top 0.508: v82.8,64.52 82.8,62.79 Q-BZ.1 | R-BZD.2 57.15,61.72 TEENSY3.6.35/A16
  Bottom 0.508: TEENSY3.6.35/A16 60.71,58.17 76.45,58.17 v82.8,64.52
CAN-RXD
  Top 0.508: MCP2551.4 34.8,27.71 | 34.8,27.71 34.69,27.71 Q-T2.3 | R-T2H.1 34.8,27.71
CAN-RXD-3V3  (via drill 0.55)
  Top 0.508: Q-T2.2 33.39,30.26 R-T2L.1 32.51,32.26 31.75,33.02 v31.75,36.83 | TEENSY3.6.4 v16,42.67
  Bottom 0.508: v16,42.67 16.26,42.93 30.73,42.93 31.75,41.91 v31.75,36.83
CAN-TXD
  Top 0.508: MCP2551.1 41.02,28.32 42.05,29.35 R-T1H.1 41.91,30.62 Q-T1.3
CAN-TXD-3V3  (via drill 0.55)
  Top 0.508: Q-T1.2 40.96,36.78 R-T1L.1 41.01,38.24 v40.39,38.86
  Bottom 0.508: TEENSY3.6.3 13.46,46.23 14.73,44.96 38.61,44.96 39.88,43.69 39.88,39.37 v40.39,38.86
CANH
  Top 0.508: MCP2551.7 39.75,19.18 40.07,18.86 ESDCAN.1 42.03,15.55 R-CANH.2 42.03,13.72 | 42.03,13.72 42.03,13.35 42.42,12.95 42.42,10.65 P_D.P$1 | R-CANM.2 39.25,13.72 42.03,13.72
CANL
  Top 0.508: MCP2551.6 38.48,19.18 38.17,18.86 ESDCAN.2 36.15,15.49 R-CANL.2 35.95,13.69 R-CANM.1 36.69,12.08 37.34,11.43 40.2,11.43 P_D.P$4
GND  (via drill 0.55, 1 pad 1.68)
  other vias: 32.51,48.51 42.16,50.55 51.82,38.35 50.29,29.46 61.21,34.29 11.94,3.56 57.15,30.73 20.83,19.05 24.89,63.75 45.97,42.93 37.34,14.99 45.97,20.57 64.26,11.18 62.99,17.27 57.4,10.41 51.82,18.03 69.85,1.78 49.28,9.91 63.75,22.35 70.61,8.64 66.29,34.29 71.63,33.02 69.34,38.61 60.2,28.45 78.49,42.16 70.87,44.96 71.12,57.15 64.26,60.45 58.93,57.91 55.63,55.12 48.77,55.12 48.26,57.91 55.37,64.26 30.73,64.01 20.32,53.34 24.89,53.34 24.89,58.67 15.49,56.39 9.65,60.45 11.43,68.07 20.83,69.09 23.62,41.66 32.26,43.69 41.15,40.64 37.34,40.64 18.8,33.53 23.62,33.53 16.26,26.67 23.88,26.67 21.34,24.13 21.08,29.21 22.1,13.72 22.35,3.56 35.31,10.92 32.77,15.24 33.02,20.07 45.21,34.54 45.97,39.37 43.18,24.13 46.23,29.72 31.5,28.96 31.75,24.38 21.08,41.66 18.54,41.66 17.27,48.51 24.89,48.51 70.87,60.45 69.85,51.82 60.96,50.55 59.18,52.32 9.4,44.7 3.3,41.91 39.88,55.37 35.05,57.66 37.59,57.66 35.05,53.59 28.96,53.59 29.72,58.93
  pour Top: -2.54,75.69 91.19,75.69 91.19,-4.83 -2.54,-4.83
  pour Bottom: -2.54,75.69 91.19,75.69 91.19,-4.83 -2.54,-4.83
MISO-3V3
  Top 0.508: Z-S2.C SPI.P$1 32.51,65.28 32.51,61.21 34.04,59.69 34.8,59.69 36.32,58.17 36.32,57.4 36.32,57.15 TEENSY3.6.12
MOSI-3V3  (via drill 0.55)
  Top 0.508: SPI.P$4 35.31,69.34 34.8,69.85 30.99,69.85 29.59,68.45 Z-S3.C 29.72,68.33 v30.99,67.06 | TEENSY3.6.11 v33.78,57.66
  Bottom 0.508: v33.78,57.66 28.7,57.66 27.43,58.93 27.43,66.29 28.19,67.06 v30.99,67.06
N$1
  Top 0.508: R-L1.1 60.57,67.7 LED1.A
N$2
  Top 0.508: R-L2.1 53.82,67.66 LED2.A
N$5
  Top 0.508: TEENSY3.6.A21 43.94,63.5 DAC.1
N$9
  Top 1.27: LIN.P$1 60.75,11.02 C-12V1.+
  Top 2.54: DIN.C LIN.P$1
N$12
  Top 0.508: LED-F.A R-LF.1
N$14
  Top 0.508: BUZZER.4 82.55,55.63 R-BZ.2
N$15
  Top 0.508: Q-BZ.3 82.55,59.61 R-BZ.1
N$25
  Top 0.508: R-CANL.1 C-CANL.2
N$26
  Top 0.508: R-CANH.1 C-CANH.2
PWM-3V3  (via drill 0.55)
  Top 0.508: v51.56,30.99 R-T4L.1 51.61,32.07 Q-T4.2 53.31,32.12 | TEENSY3.6.36/A17 54.1,59.18 54.61,58.67 v54.61,53.09
  Bottom 0.508: v51.56,30.99 54.1,30.99 54.61,31.5 54.61,40.39 55.37,41.15 55.37,48.26 54.61,49.02 v54.61,53.09
PWM-5V  (via drill 0.55)
  Top 0.508: v57.4,33.02 Q-T4.3 | PWM-ADC3.P$4 70.64,24.15 | 70.64,24.15 70.47,24.15 R-T4H.1 | v64.01,24.64 65.02,23.62 70.1,23.62 70.64,24.15
  Bottom 0.508: v64.01,24.64 64.01,26.42 v57.4,33.02
RS
  Top 0.508: R-TCD.2 41.02,20.94 MCP2551.8
S-ENC-A
  Top 0.508: C-A2.1 R-A2D.2 R-A2M.1 53.2,41.29 52.2,42.29 Z-A2.C 54.1,45.33 TEENSY3.6.29
S-ENC-A-RAW  (via drill 0.55)
  Top 0.508: R-A2U.1 65.79,27.18 v64.26,28.7 | v56.64,38.86 56.64,39.62 55.37,40.89 R-A2M.2 | v71.88,21.34 v65.79,21.34
  Bottom 0.508: v65.79,21.34 65.79,27.18 v64.26,28.7 56.64,36.32 v56.64,38.86 | STEERING-MOTOR-ENCODER.P$4 74.22,14.5 74.22,16.76 74.17,16.81 74.17,19.05 v71.88,21.34
S-ENC-B
  Top 0.508: C-A1.1 R-A1D.2 R-A1M.1 60.06,41.54 59.06,42.54 Z-A1.C 58.93,43.43 56.64,45.72 TEENSY3.6.30
S-ENC-B-RAW  (via drill 0.55)
  Top 0.508: v66.04,29.72 R-A1U.1 | v63.5,40.89 R-A1M.2 | v71.88,22.61 v67.31,22.61
  Bottom 0.508: v67.31,22.61 67.31,28.45 v66.04,29.72 62.99,32.77 62.99,40.39 v63.5,40.89 | STEERING-MOTOR-ENCODER.P$1 75.94,19.81 73.15,22.61 v71.88,22.61
SCK-3V3
  Top 0.508: TEENSY3.6.13 36.32,63.25 36.83,63.75 40.13,63.75 40.89,64.52 Z-S1.C
  Bottom 0.508: SPI.P$3 35.31,63.25 TEENSY3.6.13
SCL1-3V3  (via drill 0.55)
  Top 0.508: v52.83,52.07 52.83,57.66 51.56,58.93 TEENSY3.6.37/A18 | R-PU4.1 49.16,38.86 v48.77,38.86 | v17.78,25.4 v17.78,30.23
  Bottom 0.508: v52.83,52.07 52.83,45.47 48.77,41.4 v48.77,38.86 48.77,27.43 46.74,25.4 v17.78,25.4 13.9,25.4 LIDAR-2.P$4 | v17.78,30.23 17.78,32.44 SONAR.P$4
SCL-3V3  (via drill 0.55)
  Top 0.508: I2C.2 27.18,12.7 25.15,14.73 v25.15,17.78 v25.15,21.59 | R-PU2.1 v21.59,56.39 21.59,49.53 19.81,47.75 19.81,40.39 20.57,39.62 20.57,36.32 20.07,35.81 20.07,22.1 v20.57,21.59
  Bottom 0.508: v21.59,56.39 21.59,61.72 TEENSY3.6.19/A5 | v20.57,21.59 v25.15,21.59 9250.P$SCL | I2C1.2 I2C.2 | LIDAR-1.P$4 13.65,14.73 18.8,14.73 21.84,17.78 v25.15,17.78
SDA1-3V3  (via drill 0.55)
  Top 0.508: TEENSY3.6.38/A19 49.02,59.18 50.29,57.91 v50.29,52.83 | R-PU3.1 47.74,37.98 v47.75,37.97
  Bottom 0.508: v50.29,52.83 50.29,44.96 47.75,42.42 v47.75,37.97 47.75,29.72 45.97,27.94 16.28,27.94 SONAR.P$1 7.62,33.55 7.62,25.68 LIDAR-2.P$1
SDA-3V3  (via drill 0.55)
  Top 0.508: R-PU1.1 v23.62,56.39 23.62,49.53 22.35,48.26 22.35,25.15 v23.37,24.13 | v23.37,24.13 23.51,23.99 | v17.91,11.56 24.26,11.56 I2C.1 24.13,11.68 24.13,23.37 v23.37,24.13
  Bottom 0.508: TEENSY3.6.18/A4 v23.62,56.39 | v23.37,24.13 9250.P$SDA | I2C1.1 I2C.1 | LIDAR-1.P$1 9.15,12.7 10.29,11.56 v17.91,11.56
TESTLED
  Top 0.508: TEENSY3.6.33/A14 61.72,63.25 62.37,63.89 R-L1.2
TESTLED2
  Top 0.508: TEENSY3.6.39/A20 49.28,65.02 R-L2.2
VBAT  (via drill 0.55)
  Top 0.508: MAIN_FUSE.PIN1 55.12,13.72 55.63,13.21 55.88,13.46 64.01,13.46 64.26,13.72 64.26,17.02 v66.8,19.56 | v67.31,36.32 67.18,36.45 R-BV1.2
  Top 2.54: MAIN_FUSE.PIN1 53.98,10.43 DIN.A
  Bottom 0.508: v66.8,19.56 68.33,21.08 68.33,35.31 v67.31,36.32
VDD
  Top 2.032: P_D.P$3 45.78,12.15 MAIN_FUSE.PIN2

### Text on the board
tPlace: T | GND | AUTO / v2.0 2018 | +5V | GND | 3V3 | RX | TX | SONAR | BRK-M-ENC | LIDAR-2 | S-POT | SDA | PWM | SCL | GND | +5V | LIDAR-1 | STR-M-ENC | SDA | SCL | GND | +5V | ADC2 | POWER & CAN | +12V | PRODUCED BY / PCBWAY.COM | GND | 2-LAYER
bPlace: ADC7 | ADC6 | B | 3V3 | +5V | MOSI | GND | . | GND | A21 | AUTO v2.0 2018 / BY / HENNING SI HØJ | MISO | SCK | 3V3 | 3V3 | BZZ | +5V | GND | 3V3 | RX | TX | +5V | GND | SCL | +5V | ADC9 | SONAR | BRK-M-ENC | SDA | +3V3 | ADC8 | GND | S-POT | GND | SCL | LIDAR-2 | S-POT | +5V | SDA | +5V | SDA | PWM | GND | SCL | GND | +5V | GND | SCL | +5V | ADC1 | LIDAR-1 | STR-M-ENC | POWER & CAN | SDA | +5V | SDA | SCL | GND | +5V | CANL | B+12V | ADC2 | GND | CANH | GND | GND
Measures: _